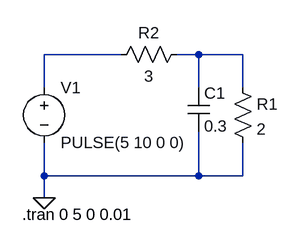
[diagram p0: schematic ResistorInSeriesAndCapacitor.asc]
ResistorInSeriesAndCapacitor.asc, the LTspice schematic file:
Version 4
SHEET 1 880 680
WIRE 176 0 64 0
WIRE 288 0 256 0
WIRE 352 0 288 0
WIRE 64 48 64 0
WIRE 288 48 288 0
WIRE 352 48 352 0
WIRE 64 176 64 128
WIRE 288 176 288 112
WIRE 288 176 64 176
WIRE 352 176 352 128
WIRE 352 176 288 176
WIRE 64 208 64 176
FLAG 64 208 0
SYMBOL res 336 32 R0
SYMATTR InstName R1
SYMATTR Value 2
SYMBOL res 272 -16 R90
WINDOW 0 0 56 VBottom 2
WINDOW 3 32 56 VTop 2
SYMATTR InstName R2
SYMATTR Value 3
SYMBOL voltage 64 32 R0
WINDOW 123 0 0 Left 0
WINDOW 39 0 0 Left 0
SYMATTR InstName V1
SYMATTR Value PULSE(5 10 0 0)
SYMBOL cap 272 48 R0
SYMATTR InstName C1
SYMATTR Value 0.3
TEXT 32 232 Left 2 !.tran 0 5 0 0.01

The netlist it stands for:
* ResistorInSeriesAndCapacitor.asc
R1 N002 0 2
R2 N002 N001 3
V1 N001 0 PULSE(5 10 0 0)
C1 N002 0 0.3
.tran 0 5 0 0.01
.backanno
.end